# Altium schematic sheet WCE_Camera_MCU.SchDoc
size A; SheetNumber: 1; SheetTotal: 1
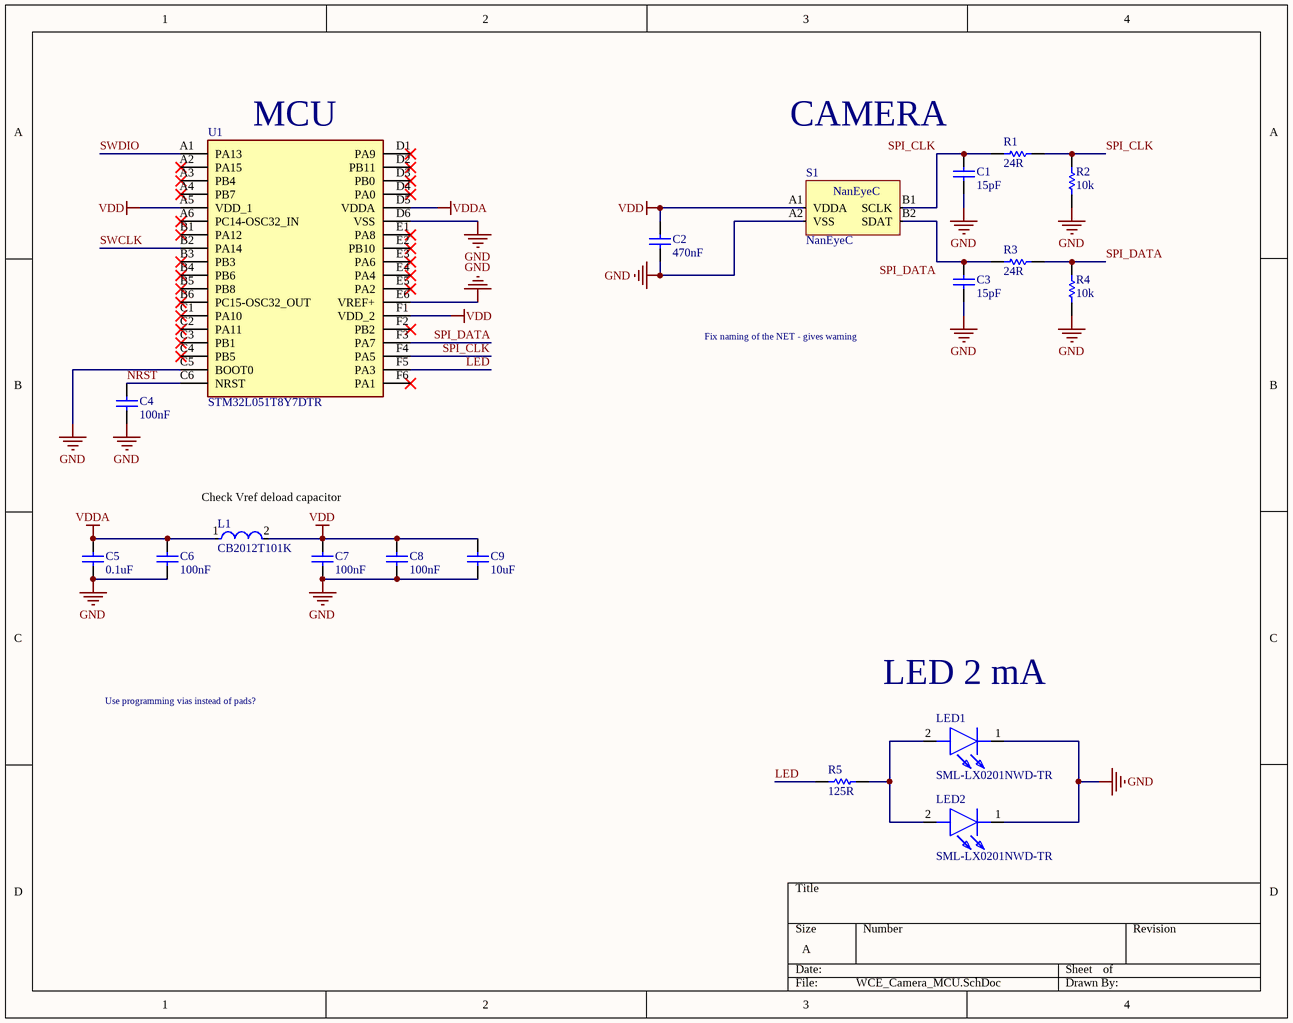
[diagram p0: WCE_Camera_MCU.SchDoc]

## Parts
C1  15pF  [CAPC0603X33X15LL03T05]
C2  470nF  [CAPC0603X33X15LL03T05]
C3  15pF  [CAPC0603X33X15LL03T05]
C4  100nF  [CAPC0603X33X15LL03T05]
C5  0.1uF  [CAPC0603X33X15LL03T05]
C6  100nF  [CAPC0603X33X15LL03T05]
C7  100nF  [CAPC0603X33X15LL03T05]
C8  100nF  [CAPC0603X33X15LL03T05]
C9  10uF  [CAPC0603X33X15LL03T05]
L1  CB2012T101K  [FP-CB2012-MFG]
LED1  SML-LX0201NWD-TR  [SML-LX0201NWD-TR]
LED2  SML-LX0201NWD-TR  [SML-LX0201NWD-TR]
R1  24R  [RESC0603X28X15NL5T05]
R2  10k  [RESC0603X28X15NL5T05]
R3  24R  [RESC0603X28X15NL5T05]
R4  10k  [RESC0603X28X15NL5T05]
R5  125R  [RESC0603X28X15NL5T05]
S1  NanEyeC  [NanEyeC]
U1  STM32L051T8Y7DTR  [STM32L051T8Y7DTR]

## Nets
GND: C1.1 C2.1 C3.1 C4.1 C5.1 C6.1 C7.1 C8.1 C9.1 LED1.1(K) LED2.1(K) R2.1 R4.1 S1.A2(VSS) U1.C5(BOOT0) U1.D6(VSS) U1.E6(VREF+)
VDD: C2.2 C7.2 C8.2 C9.2 L1.2 S1.A1(VDDA) U1.A5(VDD_1) U1.F1(VDD_2)
VDDA: C5.2 C6.2 L1.1 U1.D5(VDDA)
LED: R5.1 U1.F5(PA3)
NRST: C4.2 U1.C6(NRST)
SPI_CLK: C1.2 R1.1 R1.2 R2.2 S1.B1(SCLK) U1.F4(PA5)
SPI_DATA: C3.2 R3.1 R3.2 R4.2 S1.B2(SDAT) U1.F3(PA7)
SWCLK: U1.B2(PA14)
SWDIO: U1.A1(PA13)
NetLED1_2: LED1.2(A) LED2.2(A) R5.2

Not connected (* = marked no-connect by the designer): U1 A2(PA15)* A3(PB4)* A4(PB7)* A6(PC14-OSC32_IN)* B1(PA12)* B3(PB3)* B4(PB6)* B5(PB8)* B6(PC15-OSC32_OUT)* C1(PA10)* C2(PA11)* C3(PB1)* C4(PB5)* D1(PA9)* D2(PB11)* D3(PB0)* D4(PA0)* E1(PA8)* E2(PB10)* E3(PA6)* E4(PA4)* E5(PA2)* F2(PB2)* F6(PA1)*

## Notes on the sheet
- (near U1) MCU
- CAMERA
- Fix naming of the NET - gives warning
- Check Vref deload capacitor
- Use programming vias instead of pads?
- (near LED1) LED 2 mA

## Library data of the parts
C1 C3 = CMP-2010-00159-1: Capacitor 15 pF 0201 XR5; Part Number: 02016D104KAT2A; Manufacturer: AVX Interconnect / Elco
C2 = CMP-2010-00159-1: Capacitor 470 nF 0201 XR5; Part Number: 02016D104KAT2A; Manufacturer: AVX Interconnect / Elco
C4 C6-C8 = CMP-2010-00159-1: Capacitor 100 nF 0201 XR5; Part Number: 02016D104KAT2A; Manufacturer: AVX Interconnect / Elco
C5 = CMP-2010-00159-1: Capacitor 0.1 uF 0201 XR5; Part Number: 02016D104KAT2A; Manufacturer: AVX Interconnect / Elco
C9 = CMP-2010-00159-1: Capacitor 10 uF 0201 XR5; Part Number: 02016D104KAT2A; Manufacturer: AVX Interconnect / Elco
L1 = CMP-14484-000220-1: SMD Inductors 100uH ±10% 0.13A 9.1Ω 0805; Shielding: Unshielded; Self Resonant Frequency: 8MHz; Saturation Current: 60mA; Core Material: Ferrite; Max DC Current: 130mA; Test Frequency: 796kHz; DC Resistance (DCR): 9.1R; Length: 0.079inch; Min Operating Temperature: -40°C; Termination: SMD/SMT; Series: CB; Inductance: 100uH; Tolerance: 10%; Height - Seated (Max): 0.057inch; Package Quantity: 3000; Radiation Hardening: No; Mount: Surface Mount; Case Code (Metric): 2012; Max Operating Temperature: 105°C; Packaging: Tape and Reel; Width: 0.049inch; RoHS Compliant: Yes; Resistor Type: Wirewound; Halogen Free: Halogen Free; Case Code (Imperial): 0805; Depth: 1.45mm; Inductance Tolerance: 10%; Number of Pins: 2; Height: 0.9mm; Current Rating: 130mA; Lead Free: Lead Free; Case/Package: 0805
LED1 LED2 = SML-LX0201NWD-TR: Lumex LED 0201 SML-LX0201NWD-TR
R1-R5 = CMP-2004-00001-2: Thin film Resistor 125 OHM 0.1%-1% 100 mW (1/10 W) 0201; Voltage Rating: 30 V; Case\Package: 0201; Resistance: 0 mohm; Tolerance: 5%; Power Rating: 50 mW; REACH SVHC: Unknown; Length: 0.6 mm; Packaging: Cut Tape; Weight: 6E-06 oz; ComponentLink2URL: http://www.vishay.com/docs/20052/crcw0201e3.pdf; Mounting Technology: Surface Mount; Case Code (Imperial): 0201; Radiation Hardening: No; RoHSCompliant: true; Package Quantity: 1; Min Operating Temperature: -55 degC; Height: 0.23 mm; PackageReference: 0201; ComponentLink1Description: Manufacturer URL; ComponentLink2Description: Datasheet; Case Code (Metric): 0603; DatasheetVersion: 03/2016; Width: 0.3 mm; Mount: Surface Mount; PackageDescription: 2-Pin Surface Mount Device, Body 0.6 x 0.3 mm; ComponentLink1URL: http://www.vishay.com/; Max Operating Temperature: 155 degC
S1 = NanEyeC: Camera module NanEyeC from AMS. The Part will be delivered by us
U1 = STM32L051T8Y7DTR: STM microcontroller STM32L051T8Y7DTR WLCSP36